# EAGLE design version02 (EAGLE 5.07)
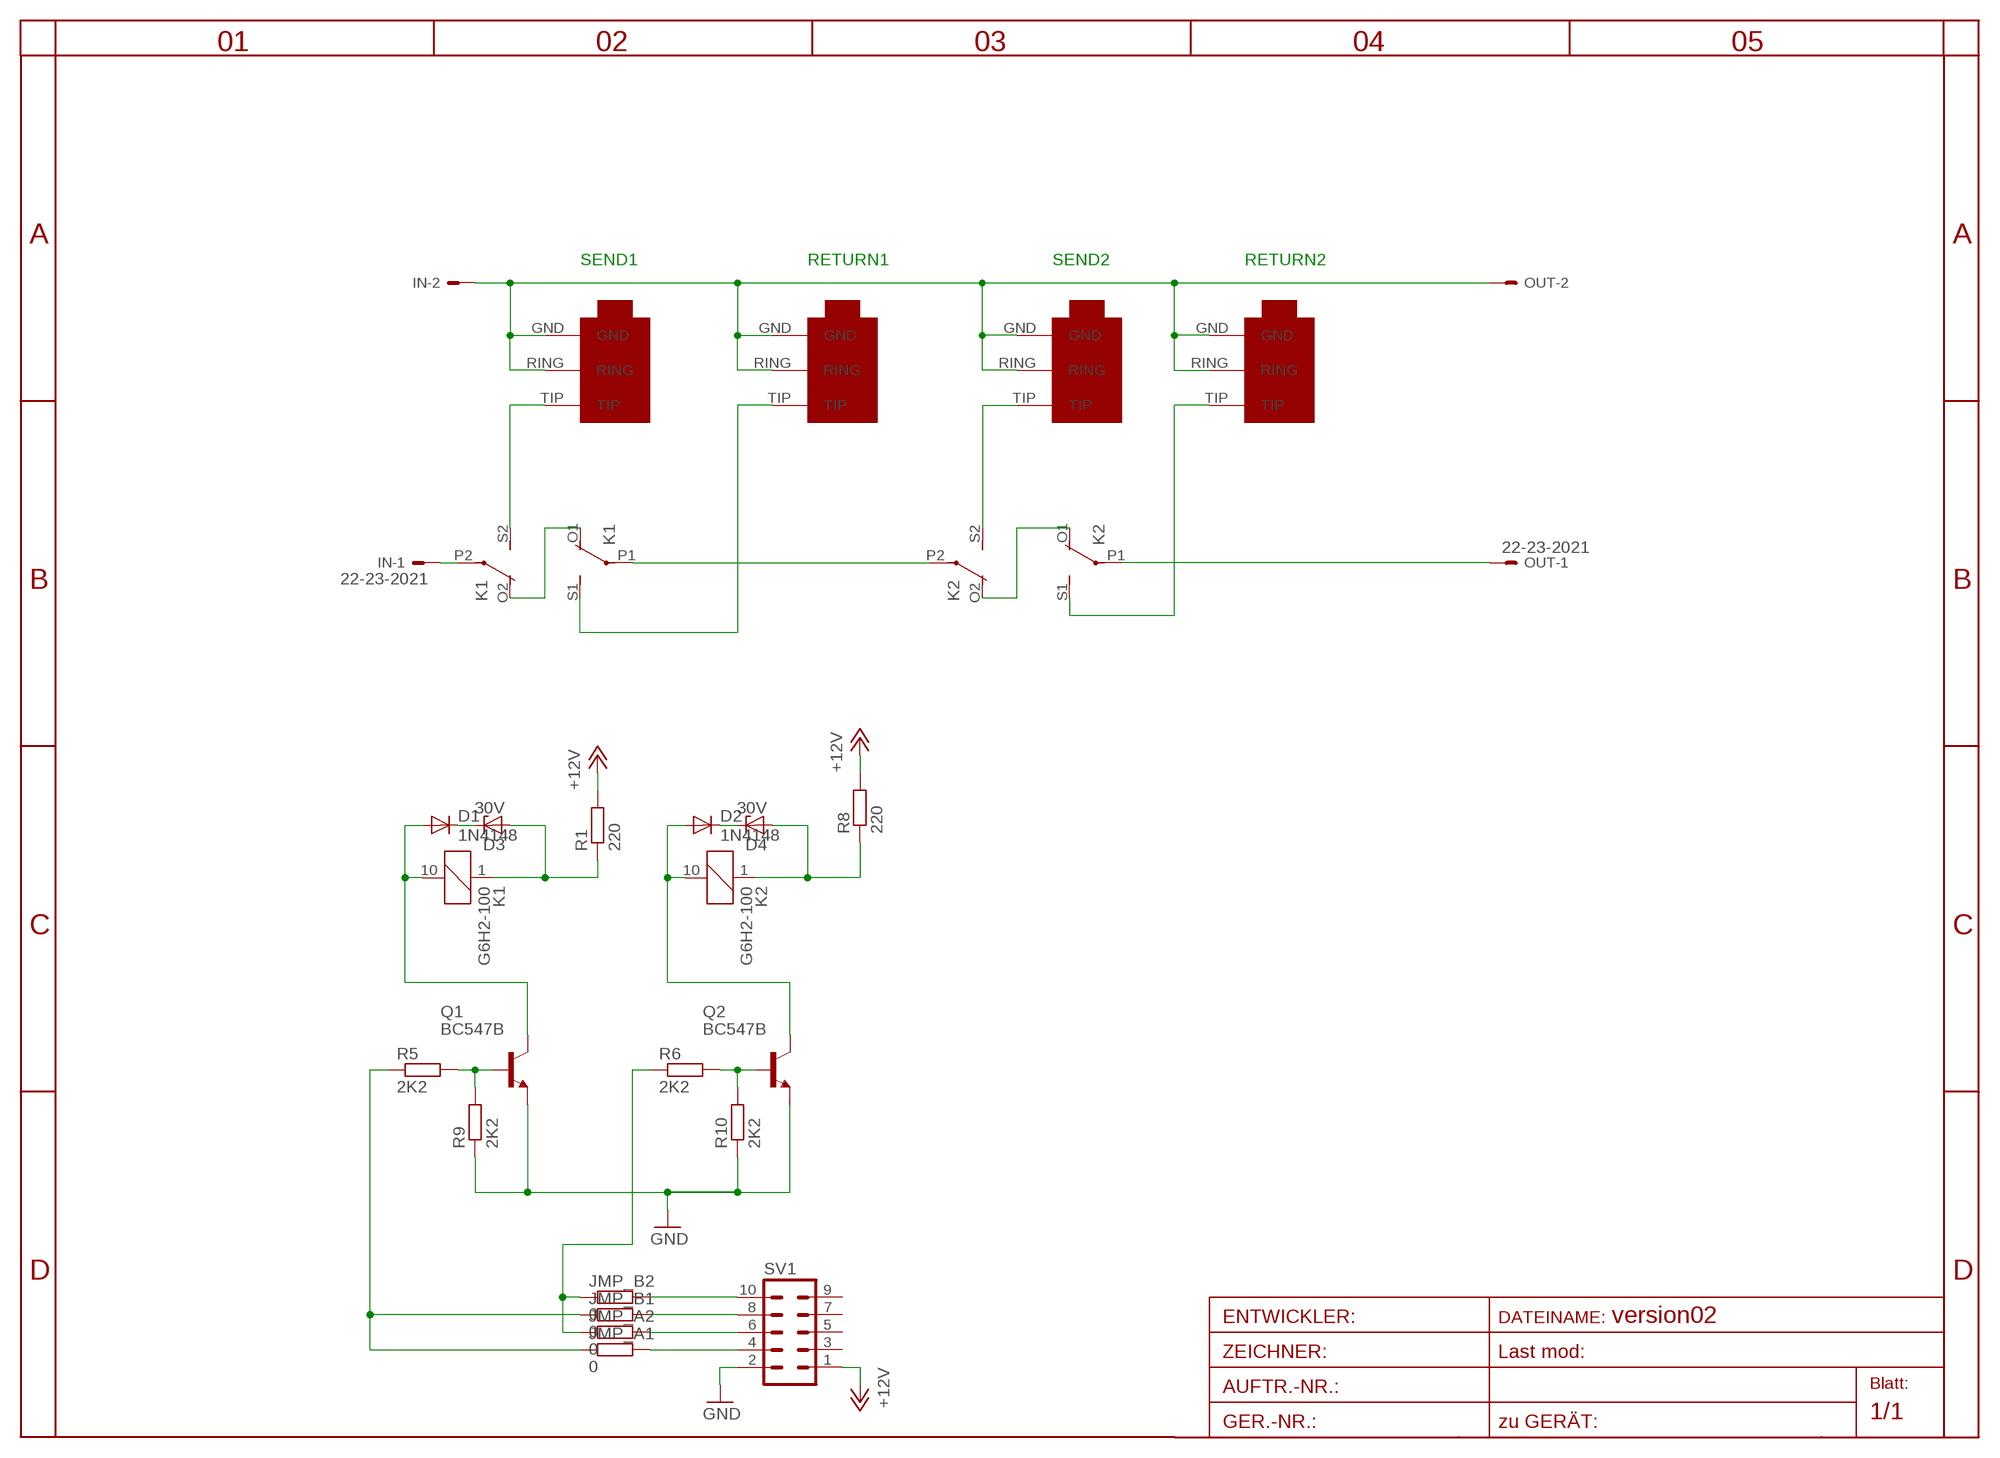
[diagram p0: schematic, sheet 1]

## Parts
D1  1N4148  [DO35-10]
D2  1N4148  [DO35-10]
D3  30V  ZPD  [DO35Z10]
D4  30V  ZPD  [DO35Z10]
IN  22-23-2021  [22-23-2021]
JMP_A1  0  R-EU_0204/5  [0204/5]
JMP_A2  0  R-EU_0204/7  [0204/7]
JMP_B1  0  R-EU_0204/5  [0204/5]
JMP_B2  0  R-EU_0204/5  [0204/5]
K1  G6H2-100  [G6H2-100]
K2  G6H2-100  [G6H2-100]
OUT  22-23-2021  [22-23-2021]
Q1  BC547B  [TO92]
Q2  BC547B  [TO92]
R1  220  R-EU_0204/7  [0204/7]
R5  2K2  R-EU_0204/7  [0204/7]
R6  2K2  R-EU_0204/7  [0204/7]
R8  220  R-EU_0204/7  [0204/7]
R9  2K2  R-EU_0204/7  [0204/7]
R10  2K2  R-EU_0204/7  [0204/7]
SV1  ML10  [ML10]
U$1  3,6ERBUCHSE  [REICHELT6,3MM]
U$2  3,6ERBUCHSE  [REICHELT6,3MM]
U$3  3,6ERBUCHSE  [REICHELT6,3MM]
U$4  3,6ERBUCHSE  [REICHELT6,3MM]

## Nets
+12V: R1.2 R8.2 SV1.1
GND: Q1.1(E) Q2.1(E) R9.1 R10.1 SV1.2
N$1: D1.C D3.C
N$2: D2.C D4.C
N$3: IN.1 K1.P2(3:P)
N$4: K1.O1(2:O) K1.O2(3:O)
N$5: K2.O1(2:O) K2.O2(3:O)
N$6: K1.P1(2:P) K2.P2(3:P)
N$7: K1.S2(3:S) U$1.TIP
N$8: K1.S1(2:S) U$2.TIP
N$9: K2.S2(3:S) U$3.TIP
N$10: K2.S1(2:S) U$4.TIP
N$11: JMP_B1.2 SV1.8
N$12: K2.P1(2:P) OUT.1
N$13: JMP_A2.2 SV1.6
N$14: JMP_A1.2 SV1.4
N$15: D4.A K2.1 R8.1
N$16: IN.2 OUT.2 U$1.GND U$1.RING U$2.GND U$2.RING U$3.GND U$3.RING U$4.GND U$4.RING
N$17: D1.A K1.10 Q1.3(C)
N$18: D3.A K1.1 R1.1
N$19: D2.A K2.10 Q2.3(C)
N$25: Q1.2(B) R5.2 R9.2
N$26: Q2.2(B) R6.2 R10.2
N$29: JMP_A1.1 JMP_B1.1 R5.1
N$30: JMP_A2.1 JMP_B2.1 R6.1
N$32: JMP_B2.2 SV1.10
Unconnected: SV1.3 SV1.5 SV1.7 SV1.9

## Notes on the sheet
- SEND1 | RETURN1 | SEND2 | RETURN2

## Library data of the parts
D1 D2 = diode:1N4148: DIODE high speed (Philips)
D3 D4 = diode:ZPD: Z DIODE 500 mW
IN OUT = con-molex:22-23-2021: .100" (2.54mm) Center Header - 2 Pin
JMP_A1 JMP_A2 JMP_B1 JMP_B2 R1 R5 R6 R8-R10 = rcl:R-EU_: RESISTOR, European symbol
K1 K2 = relay:G6H2-100: RELAY 2 x switch, 0.5 A/125 V AC, 1 A/30 V DC, Omron
Q1 Q2 = transistor-npn:BC547*: NPN Transistor
SV1 = con-harting-ml:ML10: HARTING
U$1-U$4 = con-klinke:3,6ERBUCHSE

## Net classes
0 default: width 1.143 mm
1 N$1: width 1.27 mm

## Board
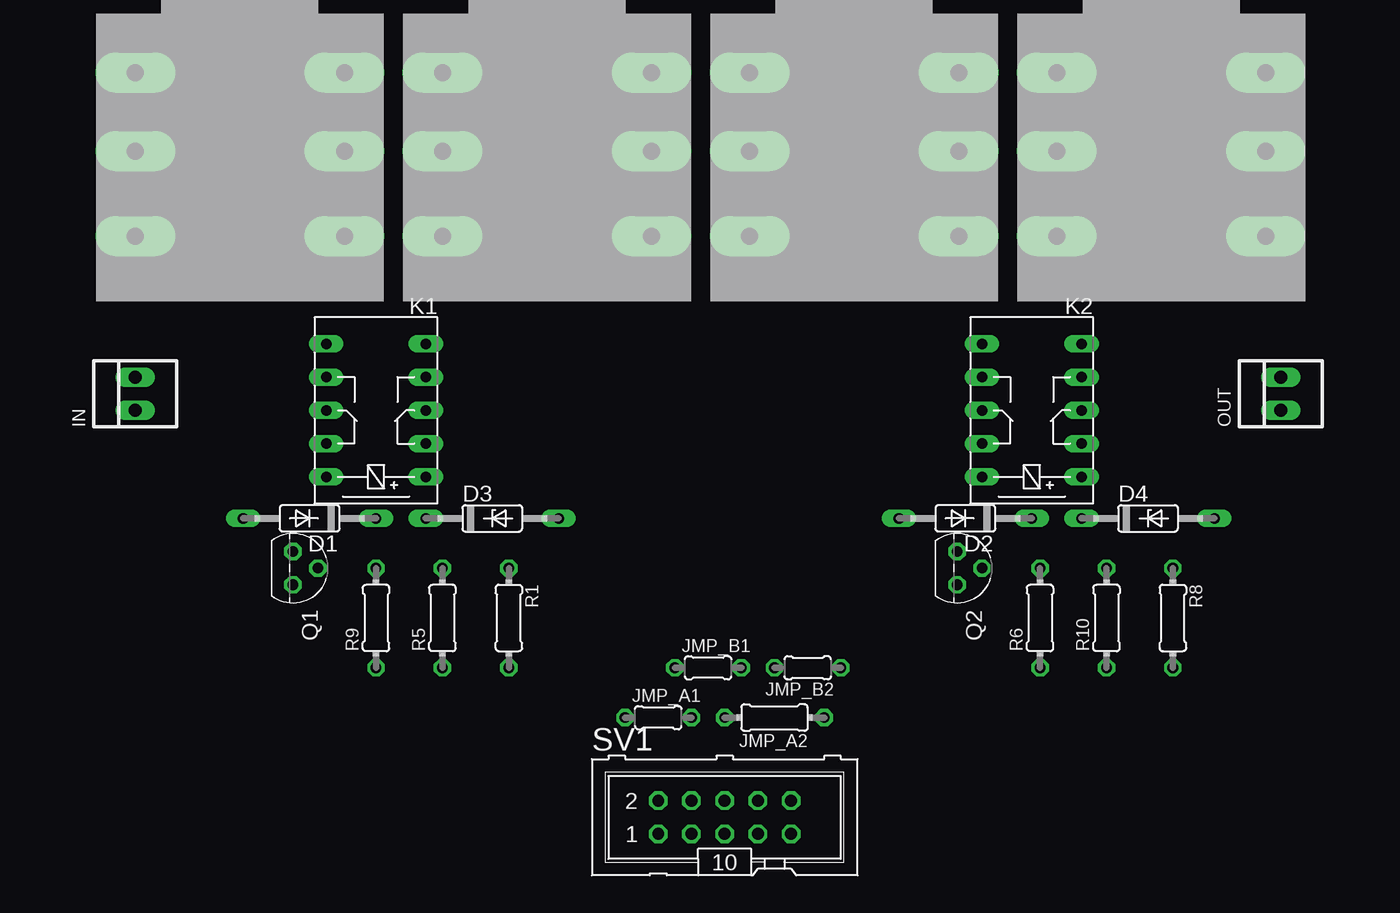
[diagram p1: board, top side]
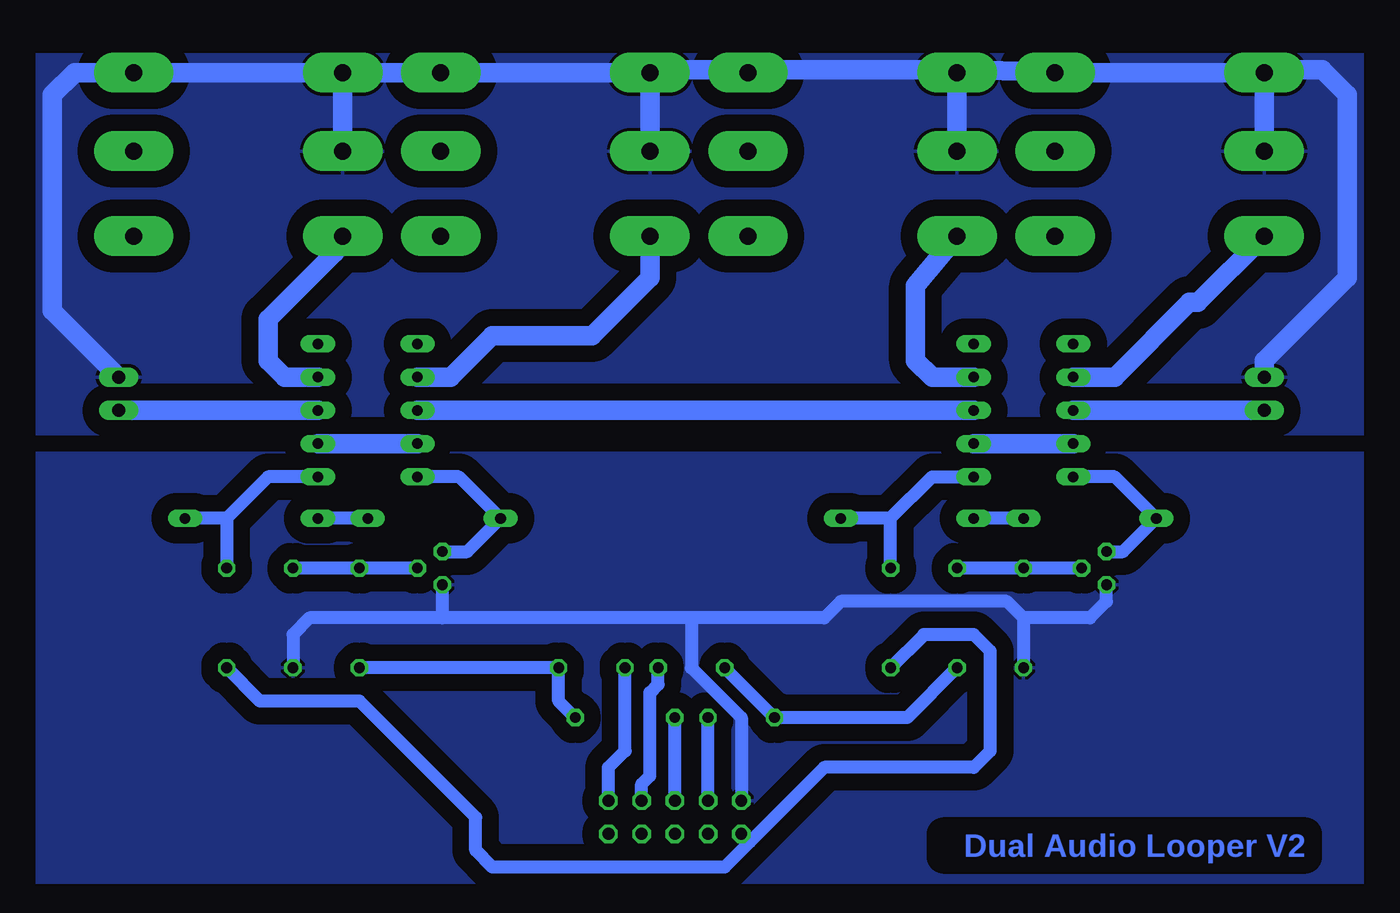
[diagram p2: board, bottom side, seen from below]

No outline drawn. Coordinates in mm, seen from the top.
Copper layers (1*16): Top 0.035mm / dielectric 1.5mm / Bottom 0.035mm
Design rules "default": minimum track width 10mil, minimum drill 24mil, track to track 8mil, track to pad 8mil, pad to pad 8mil, via to via 8mil, smd to smd 8mil, copper to edge 40mil, drill to drill 8mil, minimum pad ring 10mil, minimum via ring 8mil, stop-mask expansion 4mil, vias tented up to drill 0mil, thermal gap 10mil

### Footprints (pad centres in the part's own frame; a part is rotated, then mirrored left to right if it is on the bottom)
DO35-10 = drill 0.813 long: A 5.08,0; C -5.08,0
DO35Z10 = drill 0.813 long: A 5.08,0; C -5.08,0
22-23-2021 = drill 1 long: 1 -1.27,0; 2 1.27,0
0204/5 = drill 0.813 octagon: 1 -2.54,0; 2 2.54,0
0204/7 = drill 0.813 octagon: 1 -3.81,0; 2 3.81,0
G6H2-100 = drill 0.813 long: 1 -5.08,-3.81; 5 5.08,-3.81; 6 5.08,3.81; 10 -5.08,3.81; O1 -2.54,-3.81; O2 -2.54,3.81; P1 0,-3.81; P2 0,3.81; S1 2.54,-3.81; S2 2.54,3.81
TO92 = drill 0.813 octagon: 1 1.27,0; 2 0,1.905; 3 -1.27,0
ML10 = drill 0.914 octagon: 1 -5.08,-1.27; 2 -5.08,1.27; 3 -2.54,-1.27; 4 -2.54,1.27; 5 0,-1.27; 6 0,1.27; 7 2.54,-1.27; 8 2.54,1.27; 9 5.08,-1.27; 10 5.08,1.27
REICHELT6,3MM = drill 1.3 pad 3.048 long: GND 0,12.5; P$2 16,6.5; P$4 16,0; P$6 16,12.5; RING 0,6.5; TIP 0,0

### Placement (x,y rotation side)
D1  20.95,27.94 180 top
D2  71.12,27.94 180 top
D3  34.92,27.94 0 top
D4  85.09,27.94 0 top
IN  7.62,37.47 90 top
JMP_A1  47.62,12.7 0 top
JMP_A2  56.52,12.7 180 top
JMP_B1  51.44,16.51 0 top
JMP_B2  59.05,16.51 180 top
K1  26.04,36.2 90 top
K2  76.2,36.2 90 top
OUT  95.25,37.47 90 top
Q1  19.68,24.13 270 top
Q2  70.48,24.13 270 top
R1  36.2,20.32 270 top
R5  31.11,20.32 90 top
R6  76.83,20.32 90 top
R8  87,20.32 270 top
R9  26.04,20.32 90 top
R10  81.92,20.32 90 top
SV1  52.7,5.08 0 top
U$1  7.62,49.53 0 top
U$2  31.11,49.53 0 top
U$3  54.61,49.53 0 top
U$4  78.11,49.53 0 top

### Tracks (layer width: path | path; a pad name or v marks a point on that pad's centre or on a via)
+12V
  Bottom 1: 46.99,3.17 41.27,8.89 29.84,8.89 28.57,10.16 28.57,17.78 29.84,19.05 33.66,19.05 R1.2 | 46.99,3.17 SV1.1 | 46.99,3.17 48.9,1.27 66.67,1.27 67.94,2.54 67.94,5.08 76.83,13.97 84.45,13.97 R8.2
GND
  Bottom 1: 70.48,20.32 Q2.1 | 70.48,20.32 80.64,20.32 81.92,19.05 R10.1 | Q1.1 19.68,21.59 20.95,20.32 26.04,20.32 | SV1.2 47.62,12.7 51.44,16.51 51.44,20.32 | 51.44,20.32 70.48,20.32 | 26.04,20.32 R9.1 | 26.04,20.32 27.3,21.59 40.01,21.59 41.27,20.32 51.44,20.32
  pour Bottom (isolate 1.27): 0,33.02 101.6,33.02 101.6,0 0,0
N$1
  Bottom 1: D1.C D3.C
N$2
  Bottom 1: D2.C D4.C
N$3
  Bottom 1.5: IN.1 K1.P2
N$4
  Bottom 1.5: K1.O2 K1.O1
N$5
  Bottom 1.5: K2.O2 K2.O1
N$6
  Bottom 1.5: K1.P1 K2.P2
N$7
  Bottom 1.5: 6.99,49.53 U$1.TIP 12.7,44.45 13.34,44.45 19.05,38.73 K1.S2
N$8
  Bottom 1.5: K1.S1 33.02,38.73 34.29,40.01 34.29,45.72 U$2.TIP
N$9
  Bottom 1.5: K2.S2 69.85,38.73 66.67,41.91 59.05,41.91 54.61,46.35 U$3.TIP
N$10
  Bottom 1.5: K2.S1 82.55,38.73 83.82,40.01 83.82,43.18 78.74,48.26 U$4.TIP
N$11
  Bottom 1: SV1.8 55.24,7.62 54.61,8.26 54.61,14.61 53.98,15.24 JMP_B1.2
N$12
  Bottom 1.5: K2.P1 OUT.1
N$13
  Bottom 1: SV1.6 JMP_A2.2
N$14
  Bottom 1: SV1.4 JMP_A1.2
N$15
  Bottom 1: 87,27.94 D4.A | 87,27.94 R8.1 | 87,27.94 83.82,31.11 K2.1
N$16
  Bottom 1.5: IN.2 7.62,40.01 1.27,46.35 1.27,60.33 3.17,62.23 5.71,62.23 U$1.GND | U$1.GND 22.02,62.03 30.48,62.23 55.24,62.23 U$3.GND | U$3.GND U$4.GND | U$4.GND 79.81,62.03 80.01,61.59 | U$4.GND 98.62,62.03 100.33,60.33 100.33,43.81 OUT.2 | U$1.GND U$1.RING | U$2.RING U$2.GND | U$3.GND U$3.RING | U$4.GND U$4.RING
  pour Bottom (isolate 1.27): 0,63.5 0,34.29 101.6,34.29 101.6,63.5
N$17
  Bottom 1: Q1.3 18.41,25.4 D1.A 19.05,31.11 K1.10
N$18
  Bottom 1: 36.2,27.94 D3.A | R1.1 36.2,27.94 | 36.2,27.94 33.02,31.11 K1.1
N$19
  Bottom 1: Q2.3 68.58,25.4 D2.A 69.22,31.11 K2.10
N$25
  Bottom 1: R5.2 R9.2 Q1.2
N$26
  Bottom 1: Q2.2 R6.2 R10.2
N$29
  Bottom 1: JMP_B1.1 JMP_A1.1 34.92,12.7 R5.1
N$30
  Bottom 1: JMP_A2.1 61.59,13.97 JMP_B2.1 R6.1
N$32
  Bottom 1: SV1.10 57.78,8.89 56.52,10.16 JMP_B2.2

### Text on the board
Bottom: Dual Audio Looper V2